# EAGLE design CopyBoard64 (EAGLE 6.6.0)
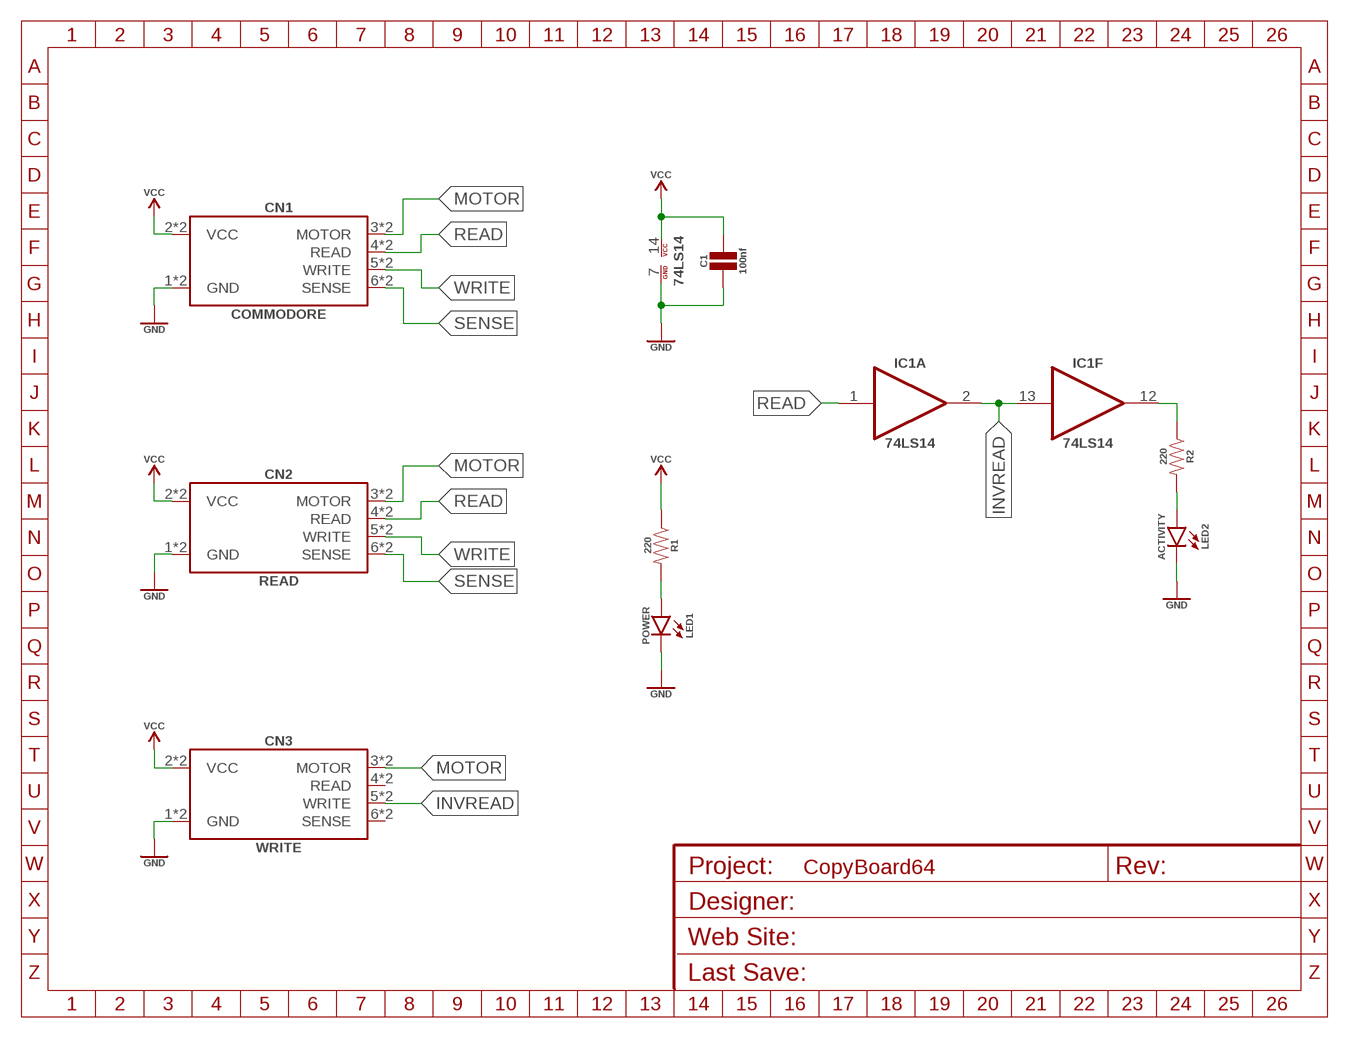
[diagram p0: schematic, sheet 1]
FRAME1 (A5L_FRAME): DESIGNER: Simon/CGTr; REVISION: 1.0; WEBSITE: http://www.commodore.gen.tr

## Parts
C1  100nf  CAPACITOR_CERAMIC_0.2  [CAPACITOR_CERAMIC_0.2]
CN1  COMMODORE  C64_DATASETTE  [C64_DATASETTE]
CN2  READ  C64_DATASETTE  [C64_DATASETTE]
CN3  WRITE  C64_DATASETTE  [C64_DATASETTE]
IC1  74LS14  [DIP14]
LED1  POWER  LED_NORMAL_03MM  [LED_03MM]
LED2  ACTIVITY  LED_NORMAL_03MM  [LED_03MM]
R1  220  RESISTOR_THT_0.3  [RESISTOR_0.3]
R2  220  RESISTOR_THT_0.3  [RESISTOR_0.3]

## Nets
GND: C1.1 CN1.1(GND) CN1.A(GND) CN2.1(GND) CN2.A(GND) CN3.1(GND) CN3.A(GND) IC1.7(P:GND) LED1.CATHODE(C) LED2.CATHODE(C)
INVREAD: CN3.5(WRITE) CN3.E(WRITE) IC1.2(A:O) IC1.13(F:I)
LEDA1: LED2.ANODE(A) R2.2
LEDA2: IC1.12(F:O) R2.1
LEDP: LED1.ANODE(A) R1.2
MOTOR: CN1.3(MOTOR) CN1.C(MOTOR) CN2.3(MOTOR) CN2.C(MOTOR) CN3.3(MOTOR) CN3.C(MOTOR)
READ: CN1.4(READ) CN1.D(READ) CN2.4(READ) CN2.D(READ) IC1.1(A:I)
SENSE: CN1.6(SENSE) CN1.F(SENSE) CN2.6(SENSE) CN2.F(SENSE)
VCC: C1.2 CN1.2(VCC) CN1.B(VCC) CN2.2(VCC) CN2.B(VCC) CN3.2(VCC) CN3.B(VCC) IC1.14(P:VCC) R1.1
WRITE: CN1.5(WRITE) CN1.E(WRITE) CN2.5(WRITE) CN2.E(WRITE)
Unconnected: CN3.4(READ) CN3.6(SENSE) CN3.D(READ) CN3.F(SENSE) IC1.3(B:I) IC1.4(B:O) IC1.5(C:I) IC1.6(C:O) IC1.8(D:O) IC1.9(D:I) IC1.10(E:O) IC1.11(E:I)

## Library data of the parts
C1 = sj_standart:CAPACITOR_CERAMIC: Ceramic Capacitor
CN1-CN3 = sj_commodore:C64_DATASETTE: C64 Datasette Pads
IC1 = sj_ic:74LS14: 74LS14 Hex Schmitt-Trigger Inverters
LED1 LED2 = sj_standart:LED_NORMAL: Standard LED
R1 R2 = sj_standart:RESISTOR: Resistor

## Board
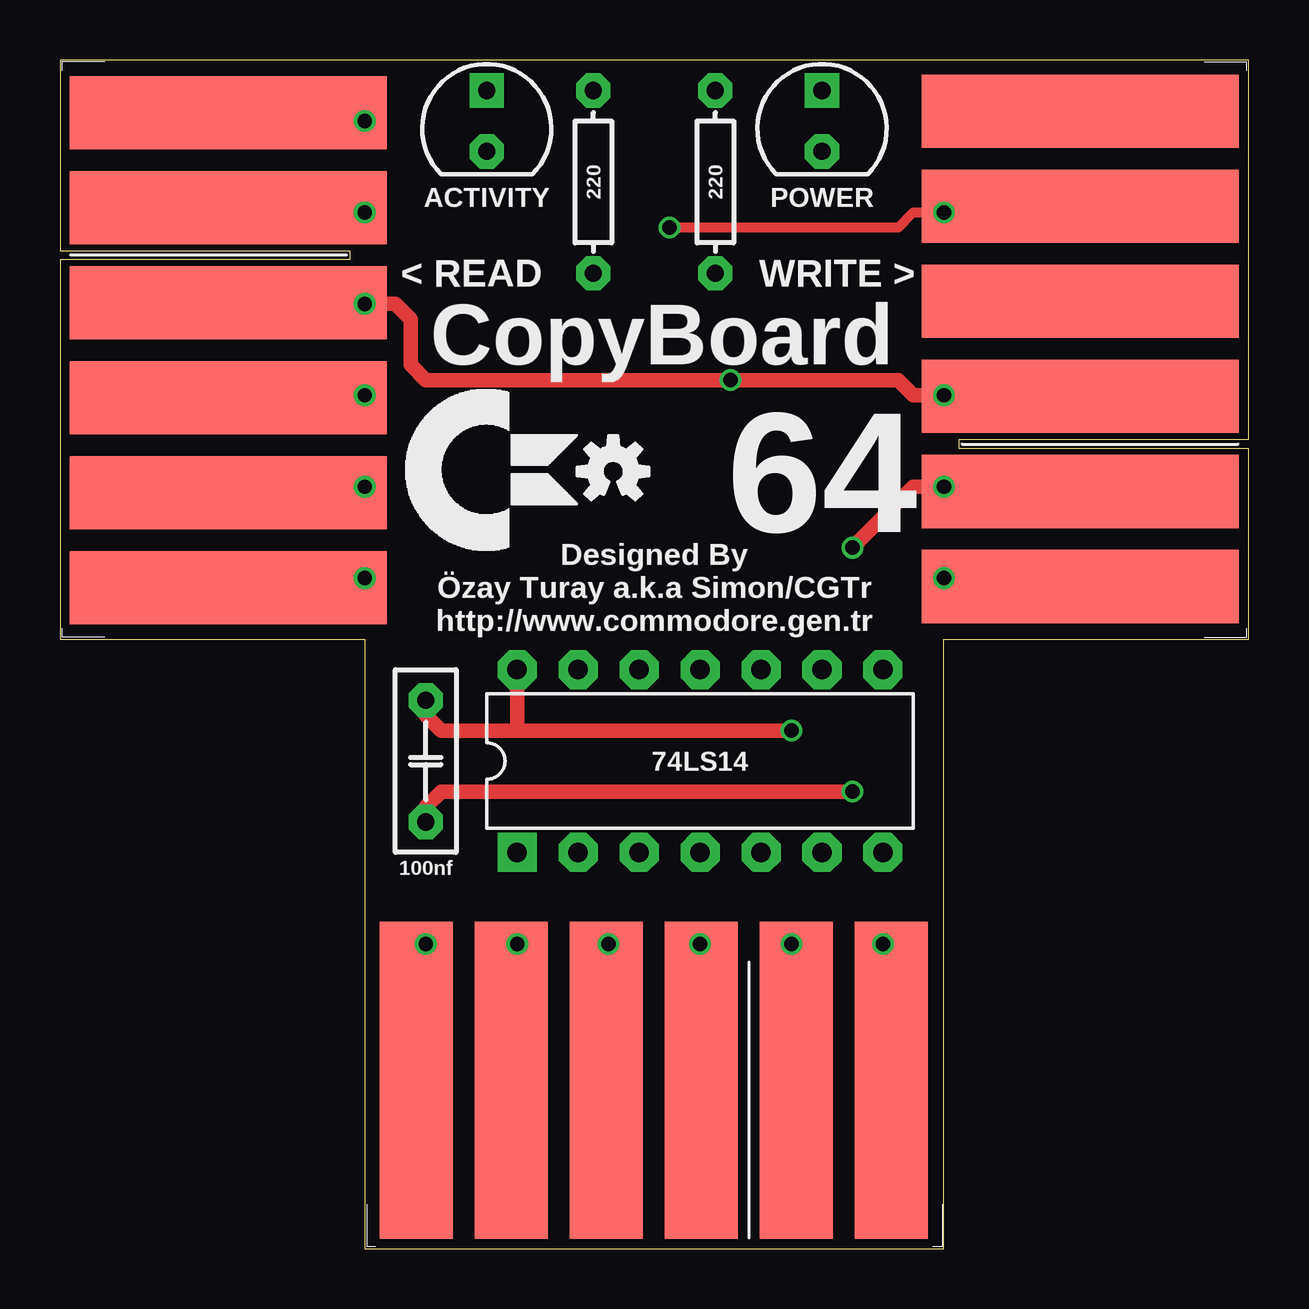
[diagram p1: board, top side]
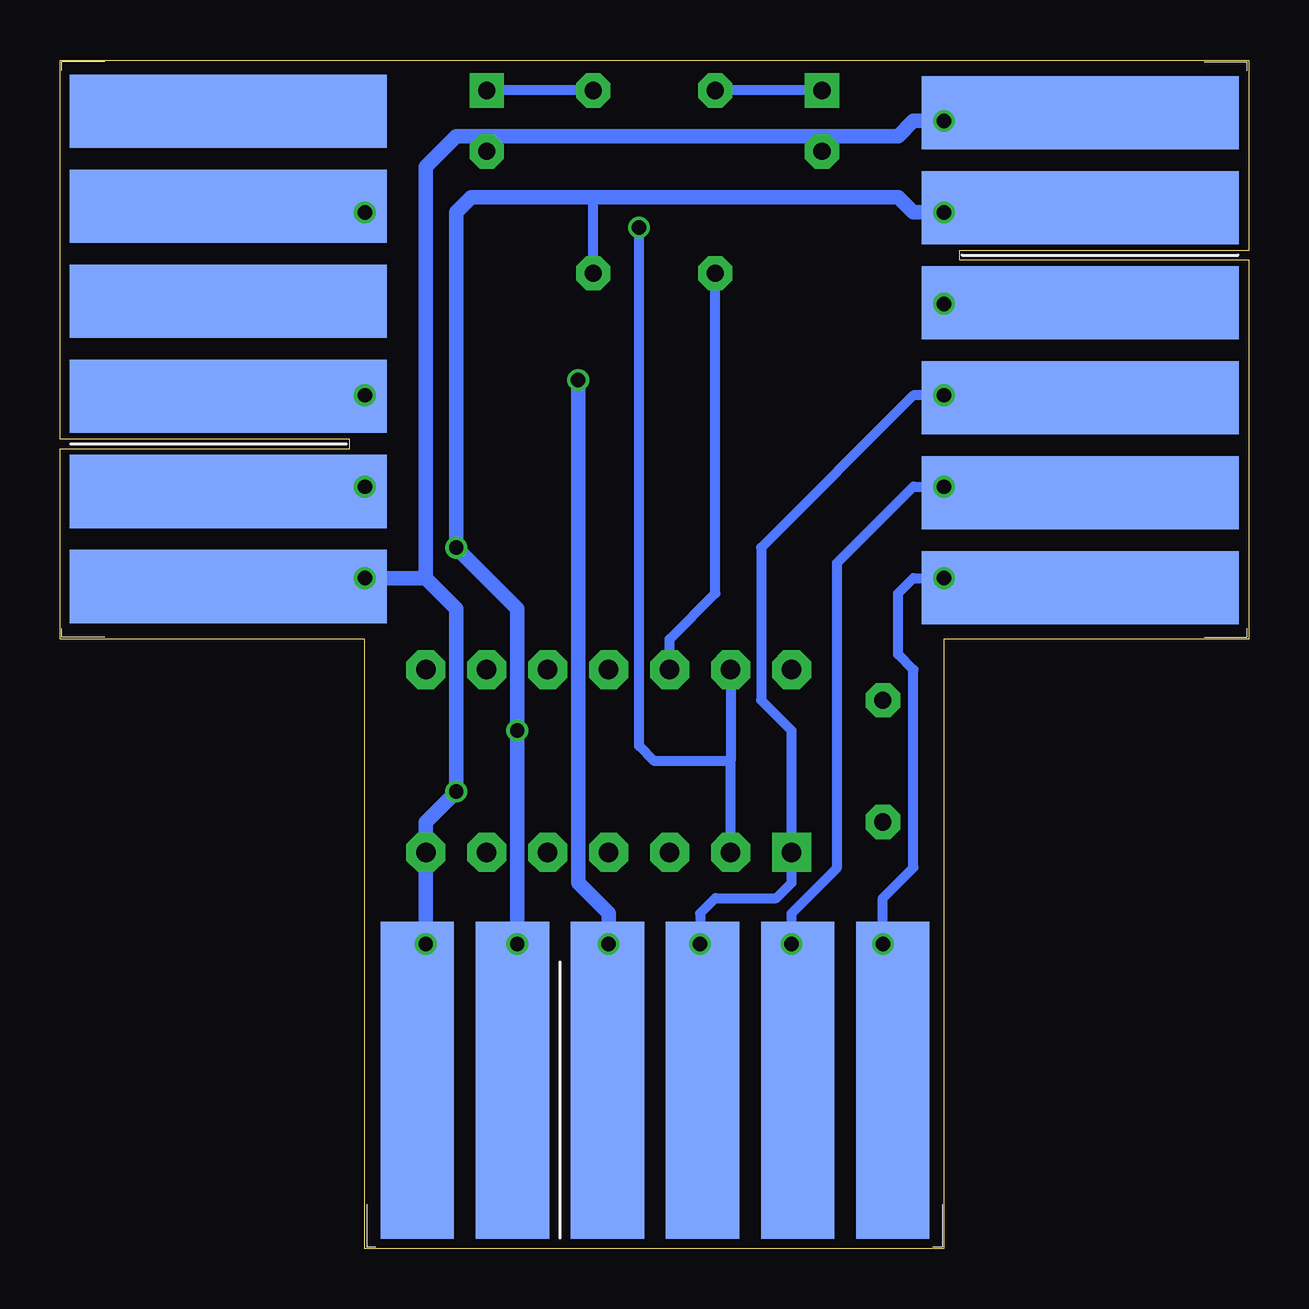
[diagram p2: board, bottom side, seen from below]

Size 49.53 x 49.53 mm. Coordinates in mm from the lower left corner, seen from the top.
Outline: 12.7,0 36.83,0 36.83,25.4 49.53,25.4 49.53,33.34 37.47,33.34 37.47,33.72 49.53,33.72 49.53,49.53 0,49.53 0,41.59 12.06,41.59 12.06,41.21 0,41.21 0,25.4 12.7,25.4 12.7,0
Copper layers (1*16): Top 0.035mm / dielectric 1.5mm / Bottom 0.035mm
Design rules "DirtyPCBs": minimum track width 5mil, minimum drill 12mil, track to track 5mil, track to pad 5mil, pad to pad 5mil, via to via 5mil, smd to smd 0mil, copper to edge 10mil, drill to drill 10mil, minimum pad ring 10mil, minimum via ring 6mil, stop-mask expansion 2mil, vias tented up to drill 25mil, thermal gap 10mil

### Footprints (pad centres in the part's own frame; a part is rotated, then mirrored left to right if it is on the bottom)
CAPACITOR_CERAMIC_0.2 = drill 0.711 pad 1.422 octagon: 1 -2.54,0; 2 2.54,0
C64_DATASETTE = smd 3.048 x 13.208: 1 -9.873,-1.241; 2 -5.913,-1.241; 3 -1.953,-1.241; 4 2.007,-1.241; 5 5.967,-1.241; 6 9.927,-1.241 | smd 3.048 x 13.208 bottom: A -9.873,-1.241; B -5.913,-1.241; C -1.953,-1.241; D 2.007,-1.241; E 5.967,-1.241; F 9.927,-1.241
DIP14 = drill 0.813 pad 1.626 square: 1 -7.62,-3.81 | drill 0.813 pad 1.626 octagon: 2 -5.08,-3.81; 3 -2.54,-3.81; 4 0,-3.81; 5 2.54,-3.81; 6 5.08,-3.81; 7 7.62,-3.81; 8 7.62,3.81; 9 5.08,3.81; 10 2.54,3.81; 11 0,3.81; 12 -2.54,3.81; 13 -5.08,3.81; 14 -7.62,3.81
LED_03MM = drill 0.711 pad 1.422 square: ANODE -1.27,0 | drill 0.711 pad 1.422 octagon: CATHODE 1.27,0
RESISTOR_0.3 = drill 0.711 pad 1.422 octagon: 1 -3.81,0; 2 3.81,0

### Placement (x,y rotation side)
C1  15.24,20.32 90 top
CN1  24.77,8.26 0 bottom
CN2  8.26,37.47 270 top
CN3  41.27,37.47 90 top
IC1  26.67,20.32 0 top
LED1  31.75,46.99 270 top
LED2  17.78,46.99 270 top
LOGO1  OSHW_LOGO_SMALL  [OSHW_LOGO_SMALL]  23.05,32.38 0 top
R1  27.3,44.45 90 top
R2  22.23,44.45 90 top

### Tracks (layer width: path | path; a pad name or v marks a point on that pad's centre or on a via)
GND  (via drill 0.6)
  Top 0.406: v12.7,46.99 7.01,46.99 CN2.1 | v36.83,27.94 42.52,27.94 CN3.1 | v34.29,12.7 34.29,7.01 CN1.1
  Top 0.61: C1.1 15.24,18.41 15.88,19.05 v33.02,19.05
  Bottom 0.406: CN2.1 7.01,46.99 v12.7,46.99 | CN1.1 34.29,7.01 v34.29,12.7 | CN3.1 42.52,27.94 v36.83,27.94 | LED2.CATHODE 17.78,46.35 | LED1.CATHODE 31.75,46.35
  Bottom 0.61: v12.7,46.99 13.97,46.99 14.61,46.35 17.78,46.35 31.75,46.35 33.02,46.35 34.29,45.09 34.29,27.94 | v34.29,12.7 IC1.7 34.29,17.78 v33.02,19.05 33.02,26.67 34.29,27.94 | 34.29,27.94 v36.83,27.94
INVREAD  (via drill 0.6)
  Top 0.406: CN3.E 42.52,43.18 v36.83,43.18 35.56,43.18 34.92,42.55 v25.4,42.55
  Bottom 0.406: CN3.E 42.52,43.18 v36.83,43.18 | IC1.2 21.59,20.32 | IC1.13 21.59,20.32 | 21.59,20.32 24.77,20.32 25.4,20.95 v25.4,42.55
LEDA1
  Bottom 0.406: LED2.ANODE R2.2
LEDA2
  Bottom 0.406: IC1.12 24.13,25.4 22.23,27.3 R2.1
LEDP
  Bottom 0.406: R1.2 LED1.ANODE
MOTOR  (via drill 0.6)
  Top 0.406: v12.7,39.37 7.01,39.37 CN2.3 | v36.83,35.56 42.52,35.56 CN3.3 | v26.67,12.7 26.67,7.01 CN1.3
  Top 0.61: v36.83,35.56 35.56,35.56 34.92,36.2 v27.94,36.2 15.24,36.2 14.61,36.83 14.61,38.73 13.97,39.37 v12.7,39.37
  Bottom 0.406: CN2.3 7.01,39.37 v12.7,39.37 | CN3.3 42.52,35.56 v36.83,35.56 | CN1.3 26.67,7.01 v26.67,12.7
  Bottom 0.61: v26.67,12.7 26.67,13.97 27.94,15.24 v27.94,36.2
READ  (via drill 0.6)
  Top 0.406: v12.7,35.56 7.01,35.56 CN2.4 | v22.86,12.7 22.86,7.01 CN1.4
  Bottom 0.406: CN2.4 7.01,35.56 v12.7,35.56 13.97,35.56 20.32,29.21 20.32,22.86 19.05,21.59 IC1.1 19.05,15.24 19.68,14.61 22.23,14.61 22.86,13.97 v22.86,12.7 22.86,7.01 CN1.4
SENSE  (via drill 0.6)
  Top 0.406: v12.7,27.94 7.01,27.94 CN2.F | v15.24,12.7 15.24,7.01 CN1.F
  Bottom 0.406: CN2.F 7.01,27.94 v12.7,27.94 13.97,27.94 14.61,27.3 14.61,24.77 13.97,24.13 13.97,15.88 15.24,14.61 v15.24,12.7 15.24,7.01 CN1.F
VCC  (via drill 0.6)
  Top 0.406: v12.7,43.18 7.01,43.18 CN2.B | v36.83,31.75 42.52,31.75 CN3.B | v30.48,12.7 30.48,7.01 CN1.B
  Top 0.61: v33.02,29.21 35.56,31.75 v36.83,31.75 | C1.2 15.24,22.23 15.88,21.59 19.05,21.59 | IC1.14 19.05,21.59 | 19.05,21.59 v30.48,21.59
  Bottom 0.406: CN2.B 7.01,43.18 v12.7,43.18 | CN3.B 42.52,31.75 v36.83,31.75 | CN1.B 30.48,7.01 v30.48,12.7 | R1.1 27.3,43.81
  Bottom 0.61: v12.7,43.18 13.97,43.18 14.61,43.81 27.3,43.81 32.38,43.81 33.02,43.18 v33.02,29.21 30.48,26.67 v30.48,21.59 30.48,13.34
  Bottom 0.813: 30.48,13.34 v30.48,12.7
WRITE  (via drill 0.6)
  Top 0.406: v12.7,31.75 7.01,31.75 CN2.5 | v19.05,12.7 19.05,7.01 CN1.5
  Bottom 0.406: CN2.5 7.01,31.75 v12.7,31.75 13.97,31.75 17.14,28.57 17.14,15.88 19.05,13.97 v19.05,12.7 19.05,7.01 CN1.5

### Text on the board
tPlace: < READ | WRITE > | CopyBoard | 64 | Designed By / Özay Turay a.k.a Simon/CGTr / http://www.commodore.gen.tr